# Altium schematic sheet Power.SchDoc
size 420 x 297 mm; SheetNumber: 3; SheetTotal: 6
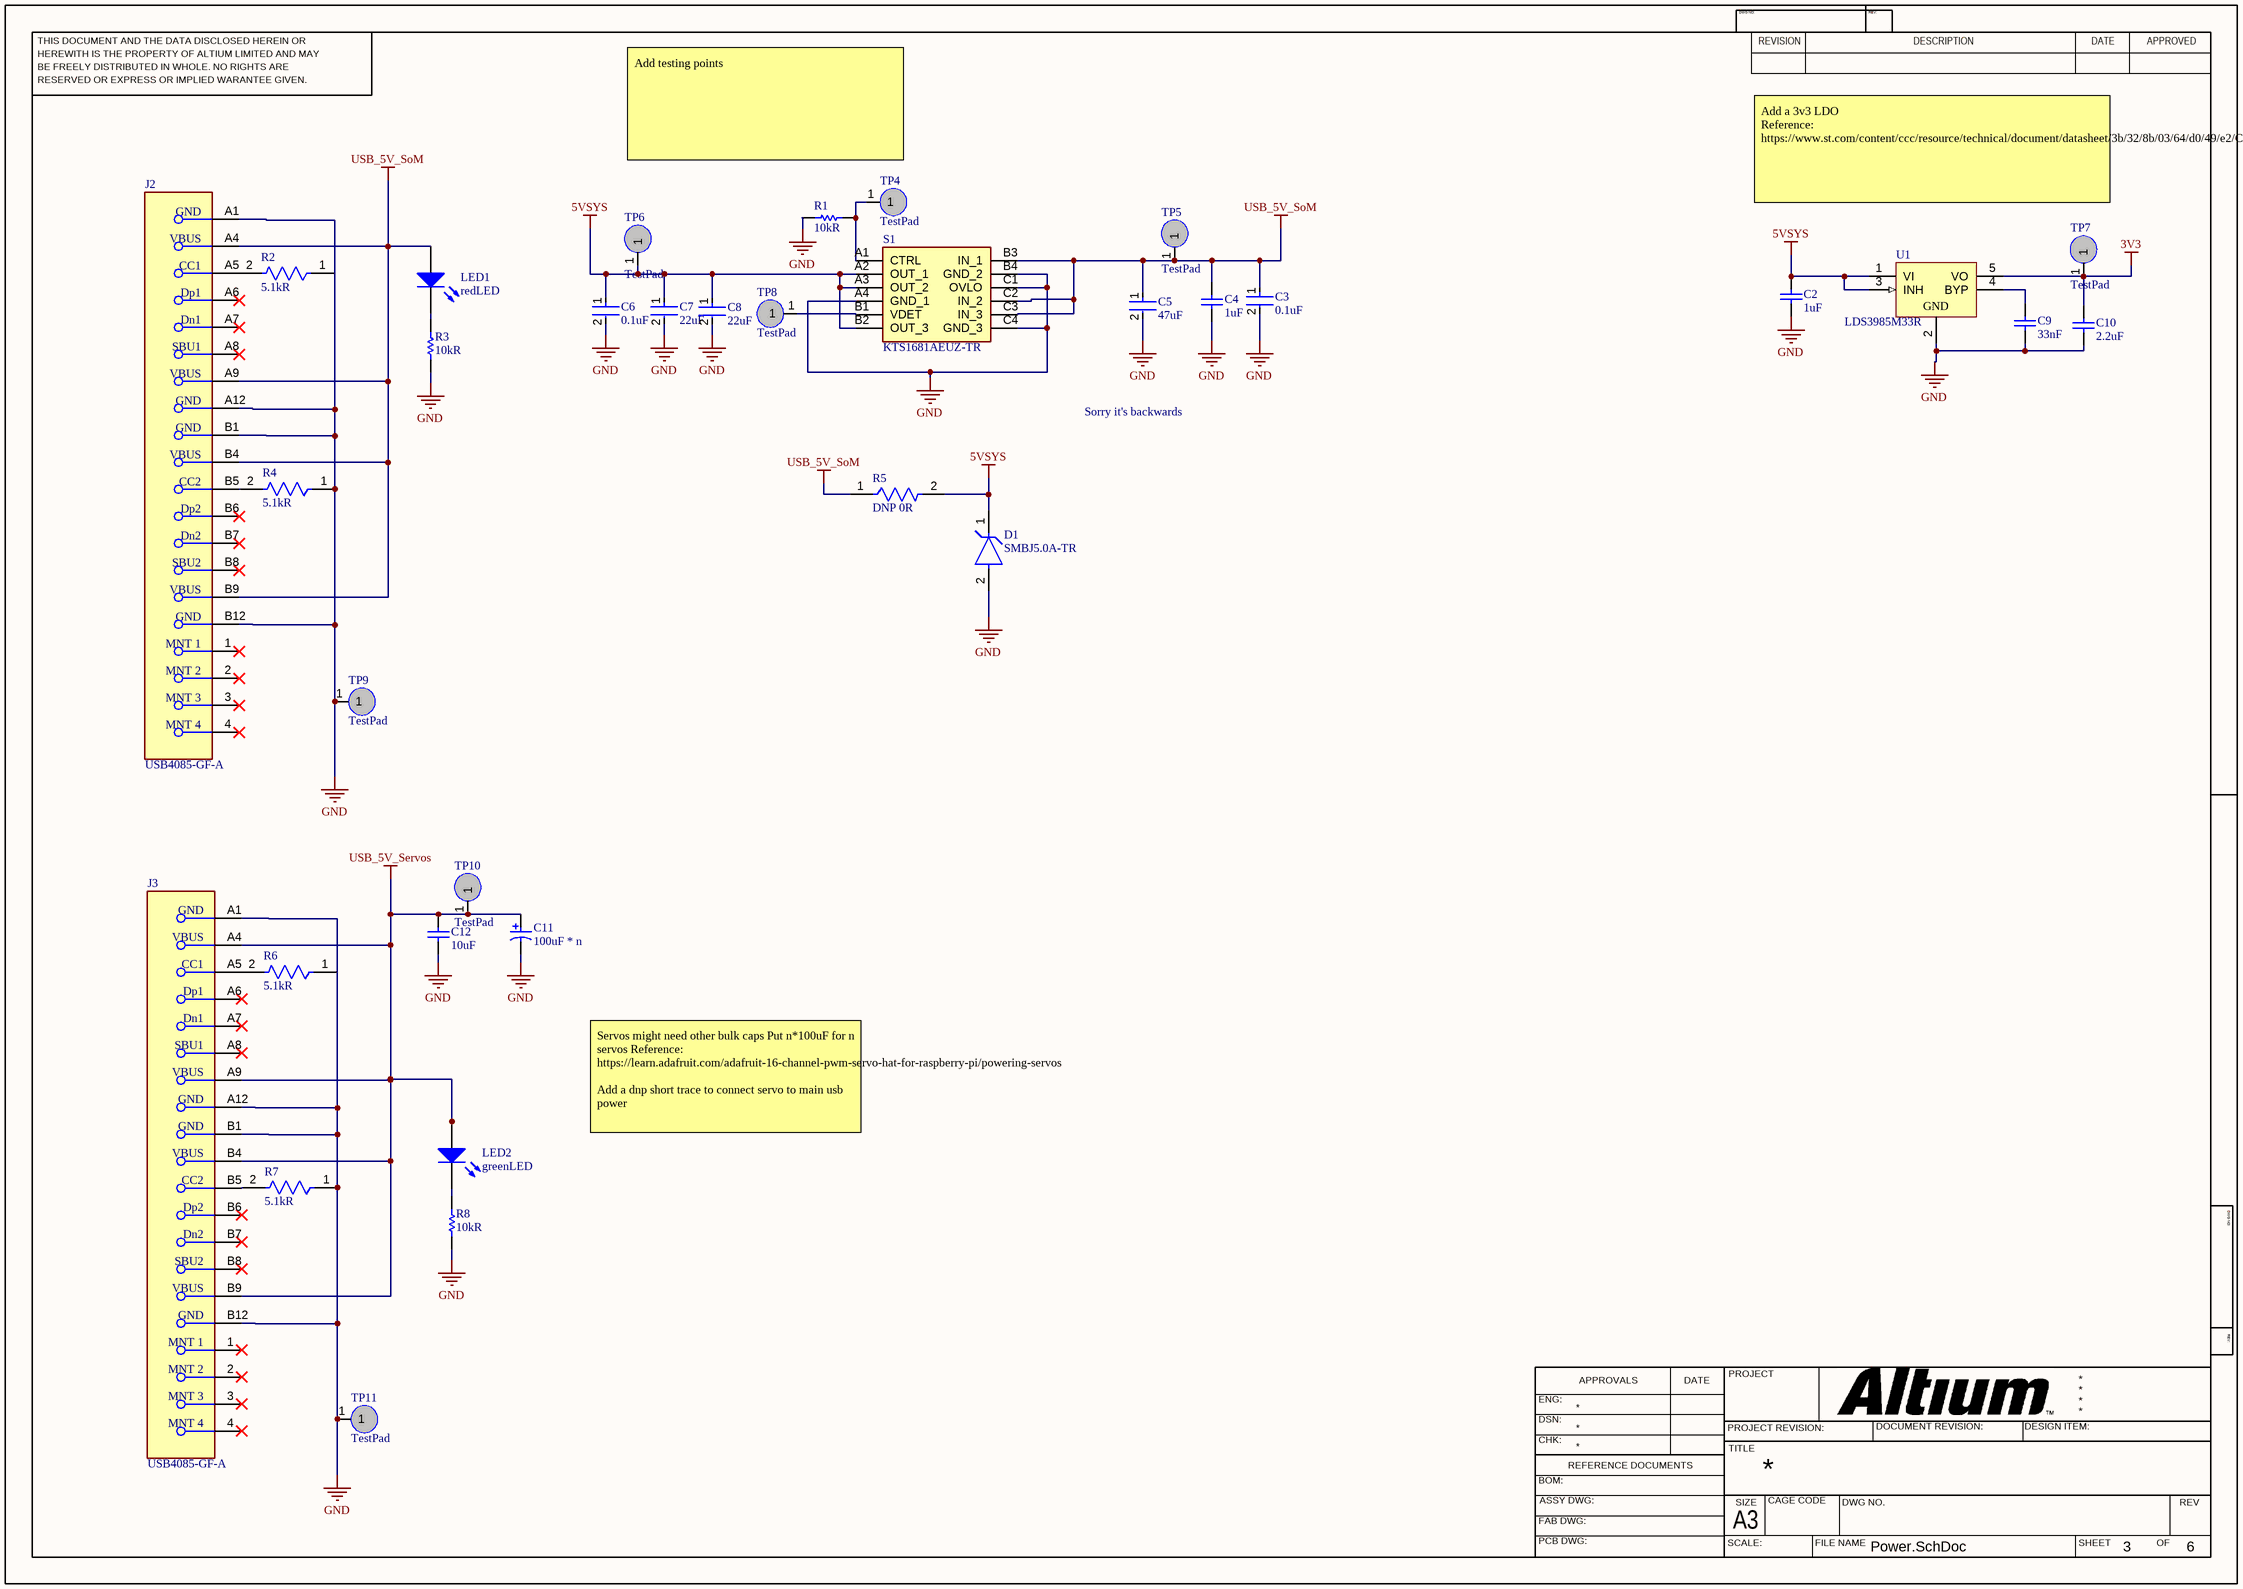
[diagram p0: Power.SchDoc]

## Parts
C2  1uF  [CAPC2013X145X50LL20T25]
C3  0.1uF  [FP-C0603-CJ-MFG]
C4  1uF  [CAPC2013X145X50LL20T25]
C5  47uF  [FP-GRM31C-0_2-e0_3_0_8-IPC_C]
C6  0.1uF  [FP-C0603-CJ-MFG]
C7  22uF  [FP-GRM21B-0_15-MFG]
C8  22uF  [FP-GRM21B-0_15-MFG]
C9  33nF  [CAPC2013X94X50LL20T25]
C10  2.2uF  [CAPC2013X135X50ML10T20]
C11  100uF * n  [CAPPR65-500-2000X1250X2200]
C12  10uF  [CAPC2013X145X20ML20]
D1  SMBJ5.0A-TR  [FP-SMB-MFG]
J2  USB4085-GF-A  [FP-USB4085-GF-A-MFG]
J3  USB4085-GF-A  [FP-USB4085-GF-A-MFG]
LED1  redLED  [0805_A]
LED2  greenLED  [0805_A]
R1  10kR  [RESC2013X60X35NL10T20]
R2  5.1kR  [FP-CRCW0805-e3-MFG]
R3  10kR  [RESC2013X60X35ML10T20]
R4  5.1kR  [FP-CRCW0805-e3-MFG]
R5  DNP 0R  [FP-RC1206-MFG]
R6  5.1kR  [FP-CRCW0805-e3-MFG]
R7  5.1kR  [FP-CRCW0805-e3-MFG]
R8  10kR  [RESC2013X60X35ML10T20]
S1  KTS1681AEUZ-TR  [KTS1681AEUZTR]
TP4  TestPad  [TestPad50mil]
TP5  TestPad  [TestPad50mil]
TP6  TestPad  [TestPad50mil]
TP7  TestPad  [TestPad50mil]
TP8  TestPad  [TestPad50mil]
TP9  TestPad  [TestPad50mil]
TP10  TestPad  [TestPad50mil]
TP11  TestPad  [TestPad50mil]
U1  LDS3985M33R  [SOT23-5L_M]

## Nets
3V3: C10.2 TP7.1 U1.5(VO)
5VSYS: C2.2 C6.1 C7.1 C8.1 D1.1(K) R5.2 S1.A2(OUT_1) S1.A3(OUT_2) S1.B2(OUT_3) TP6.1 U1.1(VI) U1.3(INH)
GND: C2.1 C3.2 C4.1 C5.2 C6.2 C7.2 C8.2 C9.1 C10.1 C11.2 C12.1 D1.2(A) J2.A1(GND) J2.A12(GND) J2.B1(GND) J2.B12(GND) J3.A1(GND) J3.A12(GND) J3.B1(GND) J3.B12(GND) R1.2 R3.1 R4.1 R7.1 R8.1 S1.A4(GND_1) S1.B4(GND_2) S1.C1(OVLO) S1.C4(GND_3) TP9.1 TP11.1 U1.2(GND)
USB_5V_Servos: C11.1 C12.2 J3.A4(VBUS) J3.A9(VBUS) J3.B4(VBUS) J3.B9(VBUS) LED2.2(A) TP10.1
USB_5V_SoM: C3.1 C4.2 C5.1 J2.A4(VBUS) J2.A9(VBUS) J2.B4(VBUS) J2.B9(VBUS) LED1.2(A) R5.1 S1.B3(IN_1) S1.C2(IN_2) S1.C3(IN_3) TP5.1
NetC9_2: C9.2 U1.4(BYP)
NetJ2_A5: J2.A5(CC1) R2.2
NetJ2_B5: J2.B5(CC2) R4.2
NetJ3_A5: J3.A5(CC1) R6.2
NetJ3_B5: J3.B5(CC2) R7.2
NetLED1_1: LED1.1(K) R3.2
NetLED2_1: LED2.1(K) R8.2
NetR1_1: R1.1 S1.A1(CTRL) TP4.1
NetS1_B1: S1.B1(VDET) TP8.1

Not connected (* = marked no-connect by the designer): J2 1(MNT_1)* 2(MNT_2)* 3(MNT_3)* 4(MNT_4)* A6(Dp1)* A7(Dn1)* A8(SBU1)* B6(Dp2)* B7(Dn2)* B8(SBU2)*; J3 1(MNT_1)* 2(MNT_2)* 3(MNT_3)* 4(MNT_4)* A6(Dp1)* A7(Dn1)* A8(SBU1)* B6(Dp2)* B7(Dn2)* B8(SBU2)*; R2 1; R6 1

## Notes on the sheet
- Add testing points
- Add a 3v3 LDO
  Reference: https://www.st.com/content/ccc/resource/technical/document/datasheet/3b/32/8b/03/64/d0/49/e2/CD00047465.pdf/files/CD00047465.pdf/jcr:content/translations/en.CD00047465.pdf
- Sorry it's backwards
- Servos might need other bulk caps Put n*100uF for n servos Reference:
  https://learn.adafruit.com/adafruit-16-channel-pwm-servo-hat-for-raspberry-pi/powering-servos
  Add a dnp short trace to connect servo to main usb power
- THIS DOCUMENT AND THE DATA DISCLOSED HEREIN OR
- HEREWITH IS THE PROPERTY OF ALTIUM LIMITED AND MAY
- DWG NO:
- REVISION
- REV:
- DESCRIPTION
- DATE
- APPROVED
- BE FREELY DISTRIBUTED IN WHOLE. NO RIGHTS ARE
- RESERVED OR EXPRESS OR IMPLIED WARANTEE GIVEN.
- ENG:
- APPROVALS
- PROJECT
- DSN:
- CHK:
- REFERENCE DOCUMENTS
- PROJECT REVISION:
- TITLE
- DOCUMENT REVISION:
- DESIGN ITEM:
- BOM:
- FAB DWG:
- PCB DWG:
- ASSY DWG:
- SCALE:
- A3
- SIZE
- CAGE CODE
- FILE NAME
- DWG NO.
- SHEET
- OF
- REV

## Library data of the parts
C2 C4 = CMP-1036-04746-2: C0805C105K4PACTU; Manufacturer: Kemet; Part Number: C0805C105K4PACTU
C3 C6 = CMP-2006-03300-2: C0603X104K5RACTU CAP CER 0.1UF 50V X7R 0603; Manufacturer: Kemet; Capacitance: 100nF; Material: Ceramic; Tolerance: 10%; Value: 100nF; Temperature Coefficient: 15%; Temperature Range High: +125°C; Temperature Range Low: -55°C; Manufacturer Part Number: C0603X104K5RACTU; Voltage: 50V; ComponentLink2Description: Datasheet; RoHS: TRUE; ComponentLink2URL: https://content.kemet.com/datasheets/KEM_C1013_X7R_FT-CAP_SMD.pdf; Device Class L3: Ceramic Capacitors; Device Class L2: Capacitors; Package: C0603-CJ; Height: 0.95mm; Device Class L1: Passive Components; Temperature Characteristic: X7R; Lead Free: Yes; Digikey Description: CAP CER 0.1UF 50V X7R 0603; Automotive: No; Mouser Description: Capacitor; Ceramic; Cap 0.1uF; Tol+10%; SMT; Flexible Termination; Vol-Rtg 50V; TR; Temperature: -55°C to +125°C; Octopart: https://octopart.com/c0603x104k5ractu-kemet-9145062; Category: Cap; Voltage Rating: 50V; Ipc Land Pattern Name: CAPC16080X80
C5 = CMP-2000-06344-2: GRM31CR60J476ME19L Chip Multilayer Ceramic Capacitors for General Purpose, 1206, 47uF, X5R, 15%, 20%, 6.3V; Package Quantity: 2000; Mount: Surface Mount; Length: 3.2mm; Thickness: 0.071inch; Lead Free: Lead Free; Tolerance: 20%; Width: 0.063inch; Depth: 1.6mm; Case/Package: 1206; Dielectric: X5R; Radiation Hardening: No; Packaging: Tape and Reel; Voltage Rating (DC): 6.3V; Termination: SMD/SMT; Height: 1.6mm; Max Operating Temperature: 85°C; Case Code (Metric): 3216; Case Code (Imperial): 1206; Voltage: 6.3V; Voltage Rating: 6.3V; Capacitance: 47uF; Min Operating Temperature: -55°C; Material: Ceramic; REACH SVHC: No SVHC
C7 C8 = CMP-2007-03385-2: GRM21BR60J226ME39L Chip Multilayer Ceramic Capacitors for General Purpose, 0805, 22uF, X5R, 15%, 20%, 6.3V; Material: Ceramic; Max Operating Temperature: 85°C; Voltage: 6.3V; Min Operating Temperature: -55°C; Case/Package: 0805; Thickness: 0.053inch; Dielectric: X5R; Packaging: Tape and Reel; Depth: 1.25mm; Termination: SMD/SMT; Voltage Rating (DC): 6.3V; Radiation Hardening: No; Tolerance: 20%; Mount: Surface Mount; Lead Free: Lead Free; Package Quantity: 1; REACH SVHC: No SVHC; Voltage Rating: 6.3V; Capacitance: 22uF; Length: 2mm; Case Code (Imperial): 0805; Case Code (Metric): 2012; Width: 0.049inch; Height: 1.25mm
C9 = CMP-1036-04167-2: 08055C333JAT2A; Manufacturer: AVX Interconnect / Elco; Part Number: 08055C333JAT2A
C10 = CMP-2007-03455-1: GRM21BR71C225KA12L; Manufacturer: Murata; Part Number: GRM21BR71C225KA12L
C11 = CMP-1665-00014-4: ECA-1JHG471 Aluminum Electrolytic Capacitor (Radial Lead Type), 470 uF, 63 V, -55 to 105 degC, 2-Pin THD, RoHS, Bulk; Manufacturer: Panasonic; Voltage Rating: 63 V; Lead Pitch: 5 mm; ComponentLink2URL: http://industrial.panasonic.com/cdbs/www-data/pdf/RDF0000/ABA0000C1038.pdf; DatasheetVersion: 03/2016; ComponentLink1URL: http://www.panasonic.com/; Mount: Through Hole; Max Operating Temperature: 105 degC; Pins: 2; Packaging: Bulk; ComponentLink1Description: Manufacturer URL; Height: 20 mm; REACH SVHC: No SVHC; RoHSCompliant: true; Mounting Technology: Through Hole; PackageDescription: 2-Pin Through Hole Device, Dia 12.5 mm, Body Length 20 mm; Package Quantity: 200; Min Operating Temperature: -55 degC; PackageReference: Radial; ComponentLink2Description: Datasheet; Length: 20 mm
C12 = CMP-2000-05452-1: C2012X7R1A106K125AC Multilayer Ceramic Chip Capacitor, 10 uF, +/- 10%, 10 V, -55 to 125 degC, 0805 (2012 Metric), RoHS, Tape and Reel; Manufacturer: TDK; PCN Part Number: MLCCPartNumberChange30/Nov/2012; Capacitance: 10µF; Voltage - Rated: 10V; Product Training Modules: CSeriesGeneralApplicationsSEAT,CCV,andTVCLDesignToolsGuidetoReplacinganElectrolyticCapacitorwithanMLCC; Online Catalog: CSeries,GeneralPurpose; Other Names: 445-6857-6; Temperature Coefficient: X7R; Features: -; Ratings: -; Operating Temperature: -55degC~125degC; RoHS Information: RoHSCertificate-MLCC; Datasheet Version: Mar-15; Package / Case: 0805(2012Metric); Series: C; Mounting Type: SurfaceMount,MLCC; Family: CeramicCapacitors; Height - Seated (Max): -; Manufacturer URL: http://www.tdk.com/; Packaging: Digi-Reel; Tolerance: ±10%; Category: Capacitors; Applications: GeneralPurpose; Standard Package: 1; Size / Dimension: 0.079"Lx0.049"W(2.00mmx1.25mm); Datasheet URL: http://download.siliconexpert.com/pdfs/2015/4/21/15/54/45/779/tdk_/manual/37024850441143360mlcc_commercial_general_en.pdf; Lead Style: -; Lead Spacing: -; Thickness (Max): 0.057"(1.45mm); Package Reference: 805; Package Description: 2-Pin Surface Mount Device, Body 2 x 1.25 mm
D1 = CMP-12225-000019-1: TVS DIODE 5V 13.4V SMB; Manufacturer: STMicroelectronics; Number Of Channels: 1; Peak Pulse Power: 600W; Clamping Voltage: 14.4V; Standoff Height: 0.05mm; Peak Pulse Current: 275A; Max Junction Temp: +150°C; Direction: Unidirectional; Breakdown Voltage: 6.4V; Device Class L3: unset; Mouser Description: SMBJ Series 600 W 5 V Uni Directional SMT TVS Diode - DO-214AA; Automotive: No; Lead Free: Yes; ComponentLink2URL: https://www.st.com/resource/en/datasheet/smbj.pdf; Package: SMB; Reverse Standoff Voltage: 5V; Device Class L1: Circuit Protection; RoHS: TRUE; Temperature Range Low: -55°C; Category: Diode; Manufacturer Part Number: SMBJ5.0A-TR; Digikey Description: TVS DIODE 5V 13.4V SMB; Height: 2.65mm; Temperature Range High: +150°C; Octopart: https://octopart.com/smbj5.0a-tr-stmicroelectronics-347079; Device Class L2: TVS Diodes; ComponentLink2Description: Datasheet; Temperature: -55°C to +150°C
J2 J3 = CMP-196119-000001-1: CONN RCPT USB2.0 TYPEC 16POS; Manufacturer: Global Connector Technology; Voltage Rating: 20V; Conn Orientation: Right Angle; Shielding: true; Current Rating: 4.25A; Number Of Contacts: 16; Pitch: 0.85mm; Is Female: yes; ComponentLink2URL: https://gct.co/files/drawings/usb4085.pdf; Category: Conn; Automotive: No; ComponentLink2Description: Datasheet; Height: 3.66mm; Manufacturer Part Number: USB4085-GF-A; Package: 0; Usb Standard: USB 2.0; Octopart: https://octopart.com/usb4085-gf-a-global+connector+technology-94773699; Device Class L3: unset; Digikey Description: CONN RCPT USB2.0 TYPEC 16POS; Temperature Range Low: -40°C; Temperature: -40°C to +85°C; Lead Free: Yes; Contact Material: Gold,Nickel; Device Class L1: Connectors; Temperature Range High: +85°C; Device Class L2: USB Connectors; RoHS: TRUE
LED1 = CMP-1426-00010-1: SMD mono-color Chip LED, WL-SMCW, Super Red; Manufacturer: Wuerth Elektronik; PartNumber: 150080SS75000; PackageReference: 0805_A; ComponentLink2URL: http://katalog.we-online.com/led/datasheet/150080SS75000.pdf; ComponentLink1URL: http://www.we-online.com; Color: Super Red; ComponentLink2Description: Datasheet; ComponentLink1Description: Manufacturer URL
LED2 = CMP-1426-00007-1: SMD mono-color Chip LED, WL-SMCW, Green; PartNumber: 150080GS75000; Manufacturer: Wuerth Elektronik; PackageReference: 0805_A; Color: Green; ComponentLink2URL: http://katalog.we-online.com/led/datasheet/150080GS75000.pdf; ComponentLink1URL: http://www.we-online.com; ComponentLink1Description: Manufacturer URL; ComponentLink2Description: Datasheet
R1 = CMP-1659-00013-4: RC0805FR-0710KL Chip Resistor, 10 KOhm, +/- 1%, 0.125 W, -55 to 155 degC, 0805 (2012 Metric), RoHS, Tape and Reel; Manufacturer: Yageo; Voltage Rating: 150 V; Mount: Surface Mount; ComponentLink1Description: Manufacturer URL; ComponentLink2URL: http://www.yageo.com/documents/recent/PYu-RC_Group_51_RoHS_L_04.pdf; Pins: 2; Length: 2 mm; Min Operating Temperature: -55 degC; Height: 0.5 mm; Mounting Technology: Surface Mount; RoHSCompliant: true; REACH SVHC: No SVHC; ComponentLink1URL: http://www.yageo.com/; Max Operating Temperature: 155 degC; PackageReference: 0805; DatasheetVersion: Rev. 4, 02/2016; Package Quantity: 5000; Packaging: Tape and Reel; ComponentLink2Description: Datasheet; PackageDescription: 2-Pin Surface Mounted Device, Body 2 x 1.25 mm
R2 R4 R6 R7 = CMP-2001-04024-2: RES Thick Film, 5.1kΩ, 1%, 0.125W, 100ppm/°C, 0805 CRCW08055K10FKEA; Power Rating: 125mW; Voltage Rating (DC): 150V; Packaging: Tape and Reel; Case Code (Metric): 2012; Contact Plating: Tin; Case Code (Imperial): 0805; Depth: 1.25mm; Tolerance: 1%; Width: 0.049inch; Temperature Coefficient: 100ppm/°C; Max Power Dissipation: 125mW; Resistance: 5.1kR; Military Standard: Not; Lead Free: Lead Free; Mount: Surface Mount; Min Operating Temperature: -55°C; Package Quantity: 10; Weight: 0.000194oz; Height: 0.45mm; Number of Terminations: 2; Max Operating Temperature: 155°C; Termination: SMD/SMT; Case/Package: 0805; Composition: Thick Film; Voltage Rating: 150V; Length: 2mm; Features: Automotive AEC-Q200; Radiation Hardening: No
R3 R8 = CMP-2100-03671-1: RC0805FR-071KL Chip Resistor, 1 KOhm, +/- 1%, 125 mW, -55 to 155 degC, 0805 (2012 Metric), RoHS, Tape and Reel; Manufacturer: Yageo; Temperature Coefficient: 100ppm/degreesC; Voltage Rating (DC): 150V; Max Power Dissipation: 125mW; Resistance: 1KOhm; Number of Pins: 2; Number of Terminations: 2; Datasheet URL: http://www.yageo.com/NewPortal/yageodocoutput?fileName=/pdf/R-Chip/PYu-RC_Group_51_RoHS_L_5.pdf; Length: 0.079inch; Package Description: 2-Pin Surface Mounted Device, Body 2 x 1.25 mm; Depth: 1.25mm; Height: 0.024inch; Military Standard: Not; Case/Package: 0805; Package Reference: 0805; RoHSCompliant: true; Lead Free: LeadFree; Packaging: TapeandReel; Package Quantity: 1; Datasheet Version: Rev. 5, 10/2016; Tolerance: 1%; Min Operating Temperature: -55degC; Voltage Rating: 150V; Composition: ThickFilm; Case Code (Imperial): 0805; Power Rating: 125mW; Width: 0.049inch; Case Code (Metric): 2012; Manufacturer URL: http://www.yageo.com/; Max Operating Temperature: 155degC; REACH SVHC: Unknown; Termination: SMD/SMT
R5 = CMP-2100-03681-2: RC1206JR-070RL RES SMD 0 OHM JUMPER 1/4W 1206; Manufacturer: YAGEO; Voltage Rating: 200V; Temperature Coefficient: 300ppm/°C; Power Rating: 0.25W; Value: 0Ω; Tolerance: 5%; Manufacturer Part Number: RC1206JR-070RL; Temperature Range Low: -55°C; Category: Res; Automotive: No; Ipc Land Pattern Name: RESC310160X55; Device Class L1: Passive Components; Temperature: -55°C to +155°C; ComponentLink2URL: https://www.yageo.com/upload/media/product/productsearch/datasheet/rchip/PYu-RC_Group_51_RoHS_L_10.pdf; Lead Free: Yes; Height: 0.65mm; Footprint Url: https://www.yageo.com/upload/website/yageo_PYu-R_Mount_10_19050818_343.pdf; Package: RC1206; Digikey Description: RES SMD 0 OHM JUMPER 1/4W 1206; Temperature Range High: +155°C; Device Class L3: Chip SMD Resistors; Device Class L2: Resistors; Octopart: https://octopart.com/rc1206jr-070rl-yageo-40025601; Resistance: 0Ω; Series: RC; ComponentLink2Description: Datasheet; Composition: Thick Film; RoHS: TRUE; Mouser Description: Resistor: thick film; SMD; 1206; 0O; 0.25W; ±5%; -55÷155°C
S1 = KTS1681AEUZ-TR: Switch; Manufacturer_Name: Kinetic Technologies; Height: 0.665mm; Manufacturer_Part_Number: KTS1681AEUZ-TR
U1 = CMP-0244-00363-1: Ultra Low Drop Low Noise BiCMOS 300 mA Voltage Regulator for use with Very Low ESR Output Capacitor, 3.3V, 5-Pin SOT-23, Tape and Reel; ComponentLink2Description: Datasheet; ComponentLink2URL: http://www.st.com/internet/com/TECHNICAL_RESOURCES/TECHNICAL_LITERATURE/DATASHEET/CD00047465.pdf; PackageDescription: 5-Pin SOT-23 Package, 2.9 x 1.6 mm Body, 0.95 mm Pitch, 2.8 mm Lead Span; ComponentLink1Description: Manufacturer URL; ComponentLink1URL: http://www.st.com; DatasheetVersion: 1/07/2010; PackageVersion: 1/01/2008; PackageReference: SOT23-5L